# Altium schematic sheet UBC-Thunderbots_PCB_Power__archive_power-v2.1_pcb__power-v2.1.SchDoc
size A4
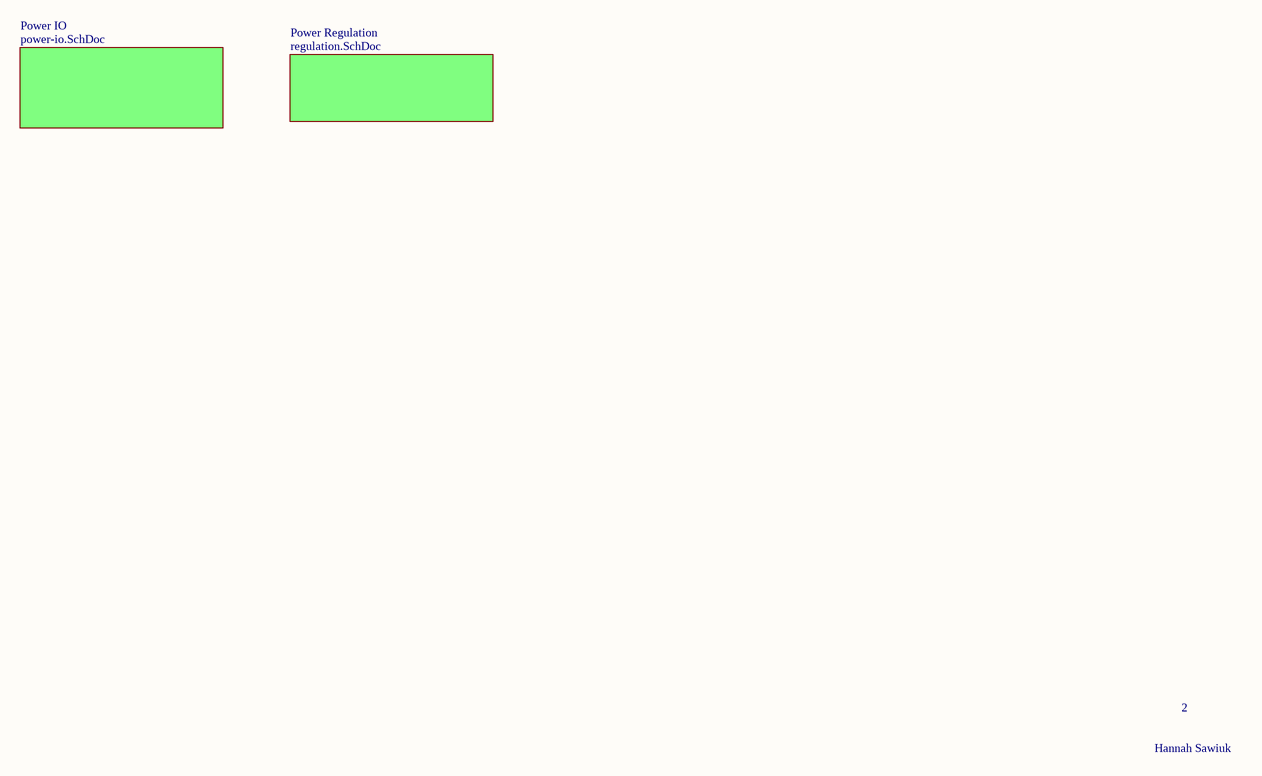
[diagram p0: UBC-Thunderbots_PCB_Power__archive_power-v2.1_pcb__power-v2.1.SchDoc]

## Sub-sheets
Power IO = power-io.SchDoc: no entries
Power Regulation = regulation.SchDoc: no entries

## Notes on the sheet
- 2
- Hannah Sawiuk